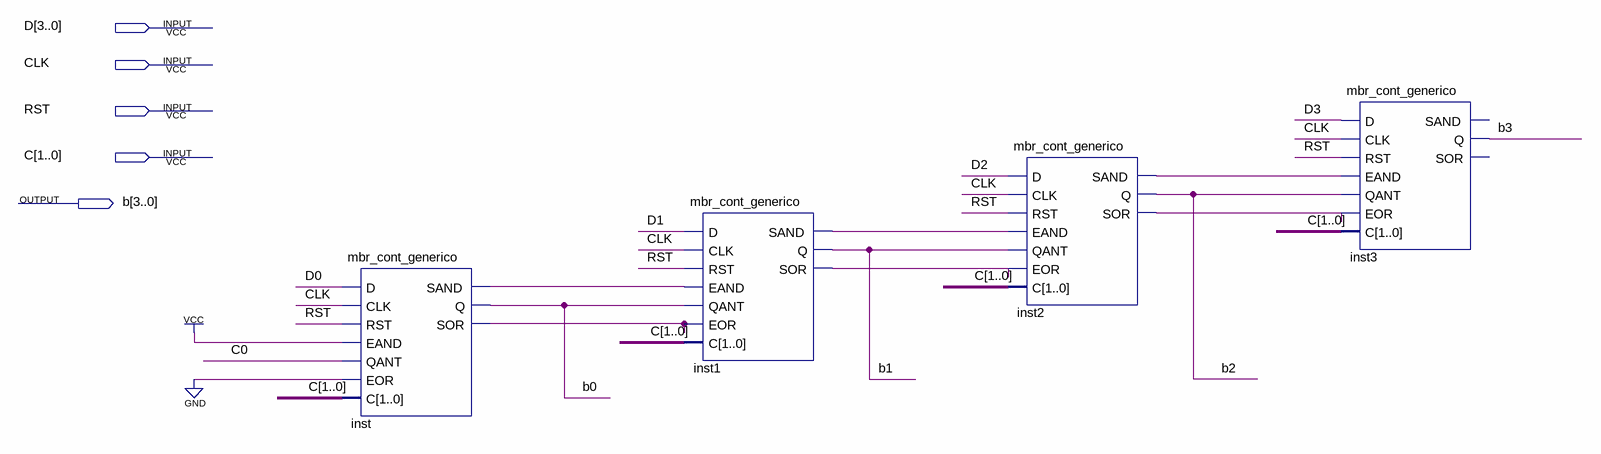
[diagram p0: schematic sheet]
// Quartus schematic mbr_cont_n_bits.bdf as structural Verilog: 4 symbols, 5 pins
module mbr_cont_n_bits (
  input  [3:0] D,
  input  CLK,
  input  RST,
  input  [1:0] C,
  output [3:0] b
);

  wire inst1_sand, inst1_sor, inst2_sand, inst2_sor, inst_sand, inst_sor;

  mbr_cont_generico inst (
    .D(D[0]), .CLK(CLK), .RST(RST), .EAND(1'b1), .QANT(C[0]), .EOR(1'b0), .C(C), .SAND(inst_sand), .Q(b[0]),
    .SOR(inst_sor));
  mbr_cont_generico inst1 (
    .D(D[1]), .CLK(CLK), .RST(RST), .EAND(inst_sand), .QANT(b[0]), .EOR(inst_sor), .C(C), .SAND(inst1_sand),
    .Q(b[1]), .SOR(inst1_sor));
  mbr_cont_generico inst2 (
    .D(D[2]), .CLK(CLK), .RST(RST), .EAND(inst1_sand), .QANT(b[1]), .EOR(inst1_sor), .C(C),
    .SAND(inst2_sand), .Q(b[2]), .SOR(inst2_sor));
  mbr_cont_generico inst3 (
    .D(D[3]), .CLK(CLK), .RST(RST), .EAND(inst2_sand), .QANT(b[2]), .EOR(inst2_sor), .C(C), .Q(b[3]));  // open: SAND, SOR
endmodule
